# Altium schematic sheet PWR_Buck_4V_20A.SchDoc: =ProjectName
size 420 x 297 mm; Author: T.P; CompanyName: WUT; DrawnBy: T.P.; Organization: WUT ISE; Address1: Warsaw Univeristy of Technology; Address2: Nowowiejska 15/19; DocumentNumber: 30; Revision: 0.9; SheetNumber: 30; SheetTotal: 36; EDA_Number: ARTIQ; Projet: ARTIQ/SINARA; ModifiedBy: -; CreateDate: XX/XX/XXXX; CheckedDate: -; Title2: PWR_Buck_4V_20A.SchDoc; DivGrp: ISE; Designer: G.K. and T.P.
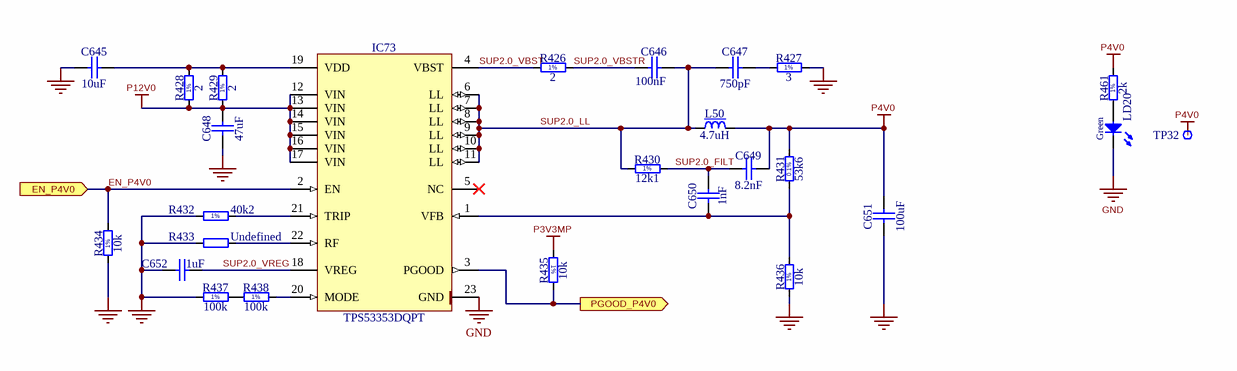
[diagram p0: PWR_Buck_4V_20A.SchDoc]

## Parts
C645  10uF  [CAPC3216X180N]
C646  100nF  [CAPC1005X55N]
C647  750pF  [CAPC1608X87N]
C648  47uF  [CAPC3225X270N]
C649  8.2nF  [CAPC1608X87N]
C650  1nF  [CAPC1005X55N]
C651  100uF  [CAPC3216X180N]
C652  1uF  [CAPC1608X87N]
IC73  TPS53353DQPT  [SON50P500X600X150-23N-R334X557]
L50  4.7uH  [IND_TDK_SPM6530]
LD20  Green  [LED_OSRAM_LGL29K]
R426  2  [RESC1608X55N]
R427  3  [RESC3216X65N]
R428  2  [RESC1608X55N]
R429  2  [RESC1608X55N]
R430  12k1  [RESC1005X40N]
R431  53k6  [RESC1608X55N]
R432  40k2  [RESC2012X60N]
R433  Undefined  [RESC1005X40N]
R434  10k  [RESC1005X40N]
R435  10k  [RESC1005X40N]
R436  10k  [RESC1005X40N]
R437  100k  [RESC1005X40N]
R438  100k  [RESC1005X40N]
R461  2k  [RESC1005X40N]
TP32  Test Point  [TPS127]  (value not drawn)

## Ports
EN_P4V0 (in), PGOOD_P4V0 (out)

## Nets
GND: C645.2 C648.1 C651.1 C652.2 IC73.23(GND) LD20.1(C) R427.2 R432.2 R433.2 R434.2 R436.1 R437.1
P3V3MP: R435.2
P4V0: C649.2 C651.2 L50.2 R431.2 R461.2 TP32.1
P12V0: C648.2 IC73.12(VIN) IC73.13(VIN) IC73.14(VIN) IC73.15(VIN) IC73.16(VIN) IC73.17(VIN) R428.1 R429.1
EN_P4V0: IC73.2(EN) R434.1 ; port EN_P4V0
PGOOD_P4V0: IC73.3(PGOOD) R435.1 ; port PGOOD_P4V0
SUP2.0_FILT: C649.1 C650.2 R430.2
SUP2.0_LL: C646.2 C647.1 IC73.6(LL) IC73.7(LL) IC73.8(LL) IC73.9(LL) IC73.10(LL) IC73.11(LL) L50.1 R430.1
SUP2.0_VBST: IC73.4(VBST) R426.1
SUP2.0_VBSTR: C646.1 R426.2
SUP2.0_VREG: C652.1 IC73.18(VREG)
NetC645_1: C645.1 IC73.19(VDD) R428.2 R429.2
NetC647_2: C647.2 R427.1
NetC650_1: C650.1 IC73.1(VFB) R431.1 R436.2
NetIC73_20: IC73.20(MODE) R438.2
NetIC73_21: IC73.21(TRIP) R432.1
NetIC73_22: IC73.22(RF) R433.1
NetLD20_2: LD20.2(A) R461.1
NetR437_2: R437.2 R438.1

Not connected (* = marked no-connect by the designer): IC73 5(NC)*

## Notes on the sheet
- Project/Equipment
- Document
- Designer
- Drawn by
- Check.by
- File
- Last Mod.
- Print Date
- Sheet
- Size
- A3
- of
- Rev
- (in symbol R0402_2K_1%_0.0625W_100PPM) 1%
- (in symbol R0402_10K_1%_0.0625W_100PPM) 1%
- (in symbol R0402_12K1_1%_0.0625W_100PPM) 1%
- (in symbol R0402_100K_1%_0.0625W_100PPM) 1%
- (in symbol R0603_2R_1%_0.1W_200PPM) 1%
- (in symbol R0603_53K6_0.1%_0.063W_10PPM) 0.1%
- (in symbol R0805_40K2_1%_0.125W_100PPM) 1%
- (in symbol R1206_3R_1%_0.25W_200PPM) 1%

## Library data of the parts
C645 = CC1206_10uF_25V_10%_X7R: Non-polarised capacitor; Manufacturer: GENERIC; Part Description: SMD Multilayer Chip Ceramic Capacitor; Manufacturer1 Part Number: C1206C106K4RACTU; Tolerance: ±10%; Voltage: 25V; TC: X7R; Manufacturer Part Number: CC1206_10uF_25V_10%_X7R; Part Number: CC1206_10UF_25V_10%_X7R; Value: 10uF; Component Kind: Standard; Component Type: Standard; Pin Count: 2; Status: Preferred; Case: 1206; Mounted: Yes; Socket: No; SMD: Yes; Sense: No; Manufacturer1 Example: KEMET; Manufacturer1 ComponentHeight: 1.8mm; HelpURL: \\cern.ch\dfs\Applications\Altium\Datasheets\CC1206_X7R_KEMET.pdf; Author: CERN DEM JLC; CreateDate: 12.09.2012; LatestRevisionDate: 12.09.2012
C646 = CC0402_100NF_16V_10%_X5R: Non-polarised capacitor; Manufacturer: GENERIC; Part Description: SMD Multilayer Chip Ceramic Capacitor; Manufacturer1 Part Number: GRM155R61C104KA88D; Tolerance: ±10%; Voltage: 16V; TC: X5R; Manufacturer Part Number: CC0402_100NF_16V_10%_X5R; Part Number: CC0402_100NF_16V_10%_X5R; Value: 100nF; Component Kind: Standard; Component Type: Standard; Pin Count: 2; Status: None; Case: 0402; Mounted: Yes; Socket: No; SMD: Yes; Sense: No; Manufacturer1 Example: MURATA; Manufacturer1 ComponentHeight: 0.55mm; HelpURL: \\cern.ch\dfs\Applications\Altium\Datasheets\CC0402_X5R_MURATA_GRM.pdf; Author: CERN DEM JLC; CreateDate: 10.12.2013; LatestRevisionDate: 10.12.2013
C647 = CC0603_750PF_50V_5%_C0G: Non-polarised capacitor; Part Description: SMD Multilayer Chip Ceramic Capacitor; Manufacturer: GENERIC; Manufacturer1 Part Number: C0603C751J5GACTU; Voltage: 50V; TC: C0G/NP0; Tolerance: ±5%; Part Number: CC0603_750PF_50V_5%_C0G; Component Kind: Standard; Component Type: Standard; Pin Count: 2; Value: 750pF; Status: Preferred; Manufacturer Part Number: CC0603_750PF_50V_5%_C0G; Case: 0603; Mounted: Yes; Socket: No; SMD: Yes; Sense: No; Manufacturer1 Example: KEMET; Manufacturer1 ComponentHeight: 0.87mm; HelpURL: \\cern.ch\dfs\Applications\Altium\Datasheets\CC0805_C0G_KEMET_(Commercial Grade).pdf; Author: CERN DEM JLC; CreateDate: 22.03.2011; LatestRevisionDate: 22.04.2015
C648 = CC1210_47UF_16V_20%_X5R: Non-polarised capacitor; Part Description: SMD Multilayer Chip Ceramic Capacitor; Manufacturer: GENERIC; Manufacturer1 Part Number: EMK325BJ476MM-T; Voltage: 16V; TC: X5R; Tolerance: ±20%; Part Number: CC1210_47UF_16V_20%_X5R; Component Kind: Standard; Component Type: Standard; Pin Count: 2; Value: 47uF; Status: None; Manufacturer Part Number: CC1210_47UF_16V_20%_X5R; Case: 1210; Mounted: Yes; Socket: No; SMD: Yes; Sense: No; Manufacturer1 Example: TAIYO YUDEN; Manufacturer1 ComponentHeight: 2.7mm; HelpURL: \\cern.ch\dfs\Applications\Altium\Datasheets\CC1210_X5R_TAIYO-YUDEN_HIGH-VALUE.pdf; Author: CERN DEM MR; CreateDate: 03.02.2016; LatestRevisionDate: 03.02.2016
C649 = CC0603_8.2NF_50V_5%_X7R: Non-polarised capacitor; Part Description: SMD Multilayer Chip Ceramic Capacitor; Manufacturer: GENERIC; Manufacturer1 Part Number: 223858615635; Voltage: 50V; TC: X7R; Tolerance: ±5%; Part Number: CC0603_8.2NF_50V_5%_X7R; Component Kind: Standard; Component Type: Standard; Pin Count: 2; Value: 8.2nF; Status: Preferred; Manufacturer Part Number: CC0603_8.2NF_50V_5%_X7R; Case: 0603; Mounted: Yes; Socket: No; SMD: Yes; Sense: No; Manufacturer1 Example: PHYCOMP; Manufacturer1 ComponentHeight: 0.87mm; HelpURL: \\cern.ch\dfs\Applications\Altium\Datasheets\CC0603_X7R_PHYCOMP.pdf; Author: CERN DEM JLC; CreateDate: 03.12.2007; LatestRevisionDate: 03.12.2007
C650 = CC0402_1NF_50V_10%_X7R: Non-polarised capacitor; Manufacturer: GENERIC; Part Description: SMD Multilayer Chip Ceramic Capacitor; Manufacturer1 Part Number: 223858715623; Tolerance: ±10%; Voltage: 50V; TC: X7R; Manufacturer Part Number: CC0402_1NF_50V_10%_X7R; Part Number: CC0402_1NF_50V_10%_X7R; Value: 1nF; Component Kind: Standard; Component Type: Standard; Pin Count: 2; Status: Not Recommended; Case: 0402; Mounted: Yes; Socket: No; SMD: Yes; Sense: No; Manufacturer1 Example: PHYCOMP; Manufacturer1 ComponentHeight: 0.55mm; HelpURL: \\cern.ch\dfs\Applications\Altium\Datasheets\CC0402_X7R_PHYCOMP.pdf; Author: CERN DEM JLC; CreateDate: 03.12.2007; LatestRevisionDate: 03.12.2007
C651 = CC1206_100UF_6.3V_20%_X5R: Non-polarised capacitor; Manufacturer: GENERIC; Part Description: SMD Multilayer Chip Ceramic Capacitor; Manufacturer1 Part Number: C1206C107M9PACTU; Tolerance: ±10%; Voltage: 6.3V; TC: X5R; Manufacturer Part Number: CC1206_100UF_6.3V_20%_X5R; Part Number: CC1206_100UF_6.3V_20%_X5R; Value: 100uF; Component Kind: Standard; Component Type: Standard; Pin Count: 2; Status: None; Case: 1206; Mounted: Yes; Socket: No; SMD: Yes; Sense: No; Manufacturer1 Example: KEMET; Manufacturer1 ComponentHeight: 1.8mm; HelpURL: \\cern.ch\dfs\Applications\Altium\Datasheets\CC1206_X5R_KEMET.pdf; Author: CERN DEM JLC; CreateDate: 26.09.2012; LatestRevisionDate: 26.09.2012
C652 = CC0603_1UF_25V_10%_X7R: Non-polarised capacitor; Manufacturer: GENERIC; Part Description: SMD Multilayer Chip Ceramic Capacitor; Manufacturer1 Part Number: GRM188R71E105KA12D; Tolerance: ±10%; Voltage: 25V; TC: X7R; Manufacturer Part Number: CC0603_1UF_25V_10%_X7R; Part Number: CC0603_1UF_25V_10%_X7R; Value: 1uF; Component Kind: Standard; Component Type: Standard; Pin Count: 2; Status: None; Case: 0603; Mounted: Yes; Socket: No; SMD: Yes; Sense: No; Manufacturer1 Example: MURATA; Manufacturer1 ComponentHeight: 0.9mm; HelpURL: \\cern.ch\dfs\Applications\Altium\Datasheets\CC0603_X7R_MURATA.pdf; Author: CERN DEM JLC; CreateDate: 18.01.2011; LatestRevisionDate: 18.01.2011
IC73 = TPS53353DQPT: 1.5V to 15V Input (4.5V to 25V Bias), 20A Synchronous Buck SWIFT™ Converter with Eco-mode™; Manufacturer: TEXAS INSTRUMENTS; Autho: TP; PressFit: No; Bonding: No; Mounted: Yes; Part Number: TPS53353DQPT; Pin Count: 23; Socket: No; Sense: No; SMD: Yes; Case: SON22; Component Kind: Standard; Component Type: Standard; ComponentHeight: 1.5mm; CreateDate: 17.01.2019; Device: TPS53353DQPT; Manufacturer Part Number: TPS53353DQPT; PackageDescription: SON, 0.50mm Pitch; 22 Pin, 5.00mm W X 6.00mm L X 1.50mm H Body (w/Thermal Tab 3.34 X 5.57mm), IPC Medium Density; Part Description: 1.5V to 15V Input (4.5V to 25V Bias), 20A Synchronous Buck SWIFT™ Converter with Eco-mode™
L50 = SPM6530T-4R7M: Inductor With Core; Part Description: SMD Inductor for Power Circuits (Wound Metal), SPM Series; Part Number: IND_4.7UH_20%_TDK_SPM6530; Manufacturer: TDK; Autho: TP; Power: 5.6A; Resistance: 0.039R; Tolerance: ±20%; Pin Count: 2; Sense: No; Socket: No; SMD: Yes; Component Kind: Standard; Component Type: Standard; ComponentHeight: 3mm; CreateDate: 16.01.2019; Manufacturer Part Number: SPM6530T-4R7M; Mounted: Yes; Status: None; Value: 4.7uH
LD20 = LED_OSRAM_LG L29K-G2J1-24-Z: LED Green 1C 2A; Manufacturer: OSRAM; Part Description: Surface Mount Green LED (0603 Case); Bonding: No; PressFit: No; Status Comment: Sourcing Difficulty; Author: CERN DEM JLC; Case: 0603; Color: Green; Component Kind: Standard; Component Type: Standard; ComponentHeight: 0.67mm; CreateDate: 24.04.2012; HelpURL: \\cern.ch\dfs\Applications\Altium\Datasheets\LED_OSRAM_LGL29K.pdf; LatestRevisionDate: 24.04.2012; Manufacturer Part Number: LG L29K-G2J1-24-Z; Mounted: Yes; PackageDescription: Green Chip LED, 2-Leads, Body 1.7x0.8mm, IPC Medium Density; Part Number: LED_OSRAM_LG L29K-G2J1-24-Z; Pin Count: 2; SMD: Yes; Socket: No; Status: Not Recommended; Sense: No
R426 R428 R429 = R0603_2R_1%_0.1W_200PPM: Resistor - 1%; Manufacturer: GENERIC; Part Description: General Purpose Thick Film Chip Resistor; Manufacturer1 Part Number: 232270462008L or RC0603FR-072RL; Power: 0.1W; TC: ±200ppm/°C; PressFit: No; Manufacturer Part Number: R0603_2R_1%_0.1W_200PPM; Part Number: R0603_2R_1%_0.1W_200PPM; Tolerance: ±1%; Value: 2; Component Kind: Standard; Component Type: Standard; Pin Count: 2; Status: Preferred; Case: 0603; Mounted: Yes; Sense: No; Socket: No; SMD: Yes; Manufacturer1 Example: YAGEO PHYCOMP; Manufacturer1 ComponentHeight: 0.65mm; HelpURL: \\cern.ch\dfs\Applications\Altium\Datasheets\R0603_Tyco_RN73.pdf; Author: CERN DEM JLC; CreateDate: 03.12.2007; LatestRevisionDate: 17.10.2012
R427 = R1206_3R_1%_0.25W_200PPM: Resistor - 1%; Manufacturer: GENERIC; Part Description: General Purpose Thick Film Chip Resistor; Manufacturer1 Part Number: 232272463008; Power: 0.25W; TC: ±200ppm/°C; PressFit: No; Manufacturer Part Number: R1206_3R_1%_0.25W_200PPM; Part Number: R1206_3R_1%_0.25W_200PPM; Tolerance: ±1%; Value: 3; Component Kind: Standard; Component Type: Standard; Pin Count: 2; Status: Preferred; Case: 1206; Mounted: Yes; Sense: No; Socket: No; SMD: Yes; Manufacturer1 Example: PHYCOMP; Manufacturer1 ComponentHeight: 0.65mm; HelpURL: \\cern.ch\dfs\Applications\Altium\Datasheets\R1206_Phycomp_RC1206.pdf; Author: CERN DEM JLC; CreateDate: 03.12.2007; LatestRevisionDate: 24.06.2009
R430 = R0402_12K1_1%_0.0625W_100PPM: Resistor - 1%; Part Description: General Purpose Thick Film Chip Resistor; Manufacturer: GENERIC; Manufacturer1 Part Number: 232270671213L or RC0402FR-0712K1L; TC: ±100ppm/°C; PressFit: No; Part Number: R0402_12K1_1%_0.0625W_100PPM; Component Kind: Standard; Component Type: Standard; Pin Count: 2; Value: 12k1; Status: Not Recommended; Power: 0.0625W; Tolerance: ±1%; Manufacturer Part Number: R0402_12K1_1%_0.0625W_100PPM; Case: 0402; Mounted: Yes; Sense: No; Socket: No; SMD: Yes; Manufacturer1 Example: YAGEO PHYCOMP; Manufacturer1 ComponentHeight: 0.4mm; HelpURL: \\cern.ch\dfs\Applications\Altium\Datasheets\R0402_Phycomp_RC0402.pdf; Author: CERN DEM JLC; CreateDate: 24.10.2012; LatestRevisionDate: 24.10.2012
R431 = R0603_53K6_0.1%_0.063W_10PPM: Resistor - 0.1%; Part Description: Thin Film Chip Resistor; Manufacturer: GENERIC; Manufacturer1 Part Number: RN73C1J53K6BTDF; Power: 0.063W; TC: ±10ppm; PressFit: No; Part Number: R0603_53K6_0.1%_0.063W_10PPM; Component Kind: Standard; Component Type: Standard; Pin Count: 2; Value: 53k6; Status: Not Recommended; Tolerance: ±0.1%; Manufacturer Part Number: R0603_53K6_0.1%_0.063W_10PPM; Case: 0603; Mounted: Yes; Sense: No; Socket: No; SMD: Yes; Manufacturer1 Example: TYCO HOLSWORTHY; Manufacturer1 ComponentHeight: 0.5mm; HelpURL: \\cern.ch\dfs\Applications\Altium\Datasheets\R0603_Tyco_RN73.pdf; Author: CERN DEM JLC; CreateDate: 03.12.2007; LatestRevisionDate: 13.03.2008
R432 = R0805_40K2_1%_0.125W_100PPM: Resistor - 1%; Part Description: Thick Film Chip Resistor; Manufacturer: VISHAY; Manufacturer1 Part Number: CRCW080540K2FKEA; Power: 0.125W; TC: ±100ppm/°C; PressFit: No; Part Number: R0805_40K2_1%_0.125W_100PPM; Component Kind: Standard; Component Type: Standard; Pin Count: 2; Value: 40k2; Status: None; Tolerance: ±1%; Manufacturer Part Number: R0805_40K2_1%_0.125W_100PPM; Case: 0805; Mounted: Yes; Sense: No; Socket: No; SMD: Yes; Manufacturer1 Example: VISHAY; Manufacturer1 ComponentHeight: 0.6mm; HelpURL: \\cern.ch\dfs\Applications\Altium\Datasheets\R2512_VISHAY_CRCW0805.pdf; Author: CERN DEM JLC; CreateDate: 18.04.2013; LatestRevisionDate: 18.04.2013
R433 = R0402_NO-VALUE: Resistor; Part Description: Reserved Footprint For a 0402 (1005) Chip Resistor; PressFit: No; Mounted: No; Manufacturer Part Number: R0402_NO-VALUE; Manufacturer: Undefined; Part Number: R0402_NO-VALUE; Value: Undefined; Component Kind: Standard; Component Type: Standard; Pin Count: 2; Status: None; Case: 0402; Sense: No; Socket: No; SMD: Yes; Manufacturer1 Example: Undefined; Manufacturer1 Part Number: Undefined; Manufacturer1 ComponentHeight: Undefined; HelpURL: Undefined; Author: CERN DEM JLC; CreateDate: 03.12.2007; LatestRevisionDate: 13.03.2008
R434 R435 = R0402_10K_1%_0.0625W_100PPM: Resistor - 1%; Manufacturer: GENERIC; Part Description: General Purpose Thick Film Chip Resistor; Manufacturer1 Part Number: 232270671003L; TC: ±100ppm/°C; PressFit: No; Manufacturer Part Number: R0402_10K_1%_0.0625W_100PPM; Part Number: R0402_10K_1%_0.0625W_100PPM; Tolerance: ±1%; Value: 10k; Component Kind: Standard; Component Type: Standard; Pin Count: 2; Status: Not Recommended; Power: 0.0625W; Case: 0402; Mounted: Yes; Sense: No; Socket: No; SMD: Yes; Manufacturer1 Example: YAGEO PHYCOMP; Manufacturer1 ComponentHeight: 0.4mm; HelpURL: \\cern.ch\dfs\Applications\Altium\Datasheets\R0402_Phycomp_RC0402.pdf; Author: CERN DEM JLC; CreateDate: 03.12.2007; LatestRevisionDate: 17.10.2012
R436 = R0402_10K_1%_0.0625W_100PPM: Resistor - 1%; Part Description: General Purpose Thick Film Chip Resistor; Manufacturer: GENERIC; Manufacturer1 Part Number: 232270671003L; TC: ±100ppm/°C; PressFit: No; Part Number: R0402_10K_1%_0.0625W_100PPM; Component Kind: Standard; Component Type: Standard; Pin Count: 2; Value: 10k; Status: Not Recommended; Power: 0.0625W; Tolerance: ±1%; Manufacturer Part Number: R0402_10K_1%_0.0625W_100PPM; Case: 0402; Mounted: Yes; Sense: No; Socket: No; SMD: Yes; Manufacturer1 Example: YAGEO PHYCOMP; Manufacturer1 ComponentHeight: 0.4mm; HelpURL: \\cern.ch\dfs\Applications\Altium\Datasheets\R0402_Phycomp_RC0402.pdf; Author: CERN DEM JLC; CreateDate: 03.12.2007; LatestRevisionDate: 17.10.2012
R437 R438 = R0402_100K_1%_0.0625W_100PPM: Resistor - 1%; Manufacturer: GENERIC; Part Description: General Purpose Thick Film Chip Resistor; Manufacturer1 Part Number: 232270671004L; TC: ±100ppm/°C; PressFit: No; Manufacturer Part Number: R0402_100K_1%_0.0625W_100PPM; Part Number: R0402_100K_1%_0.0625W_100PPM; Tolerance: ±1%; Value: 100k; Component Kind: Standard; Component Type: Standard; Pin Count: 2; Status: Not Recommended; Power: 0.0625W; Case: 0402; Mounted: Yes; Sense: No; Socket: No; SMD: Yes; Manufacturer1 Example: YAGEO PHYCOMP; Manufacturer1 ComponentHeight: 0.4mm; HelpURL: \\cern.ch\dfs\Applications\Altium\Datasheets\R0402_Phycomp_RC0402.pdf; Author: CERN DEM JLC; CreateDate: 03.12.2007; LatestRevisionDate: 17.10.2012
R461 = R0402_2K_1%_0.0625W_100PPM: Resistor - 1%; Part Description: General Purpose Thick Film Chip Resistor; Manufacturer: GENERIC; Manufacturer1 Part Number: 232270672002L; TC: ±100ppm/°C; PressFit: No; Part Number: R0402_2K_1%_0.0625W_100PPM; Component Kind: Standard; Component Type: Standard; Pin Count: 2; Value: 2k; Status: Not Recommended; Power: 0.0625W; Tolerance: ±1%; Manufacturer Part Number: R0402_2K_1%_0.0625W_100PPM; Case: 0402; Mounted: Yes; Sense: No; Socket: No; SMD: Yes; Manufacturer1 Example: YAGEO PHYCOMP; Manufacturer1 ComponentHeight: 0.4mm; HelpURL: \\cern.ch\dfs\Applications\Altium\Datasheets\R0402_Phycomp_RC0402.pdf; Author: CERN DEM JLC; CreateDate: 03.12.2007; LatestRevisionDate: 17.10.2012
TP32 = SMD_PAD_1.27X1.27MM: Part Description: 1.27mm x 1.27mm PCB Copper Area (SMD Test Point); Mounted: No; Part Number: SMD_PAD_1.27X1.27MM; Component Kind: Standard (No BOM); Component Type: Standard (No BOM); Pin Count: 1; Family: Test Point; Socket: No; SMD: Yes; Sense: No; Status: None; ComponentHeight: 0mm; HelpURL: Undefined; Author: CERN DEM JLC; CreateDate: 12.01.2008; LatestRevisionDate: 12.01.2008; PackageDescription: 1.27mm x 1.27mm PCB Copper Area (SMD Test Point)